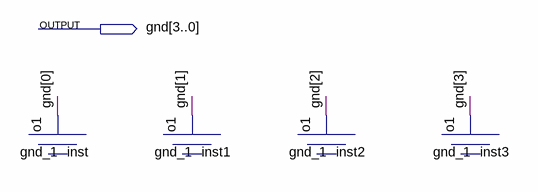
[diagram p0: schematic sheet]
// Quartus schematic gnd_4.bdf as structural Verilog: 4 symbols, 1 pins
module gnd_4 (
  output [3:0] gnd
);

  gnd_1 inst (.o1(gnd[0]));
  gnd_1 inst1 (.o1(gnd[1]));
  gnd_1 inst2 (.o1(gnd[2]));
  gnd_1 inst3 (.o1(gnd[3]));
endmodule
